# Altium schematic sheet Microcontroller.SchDoc
size A
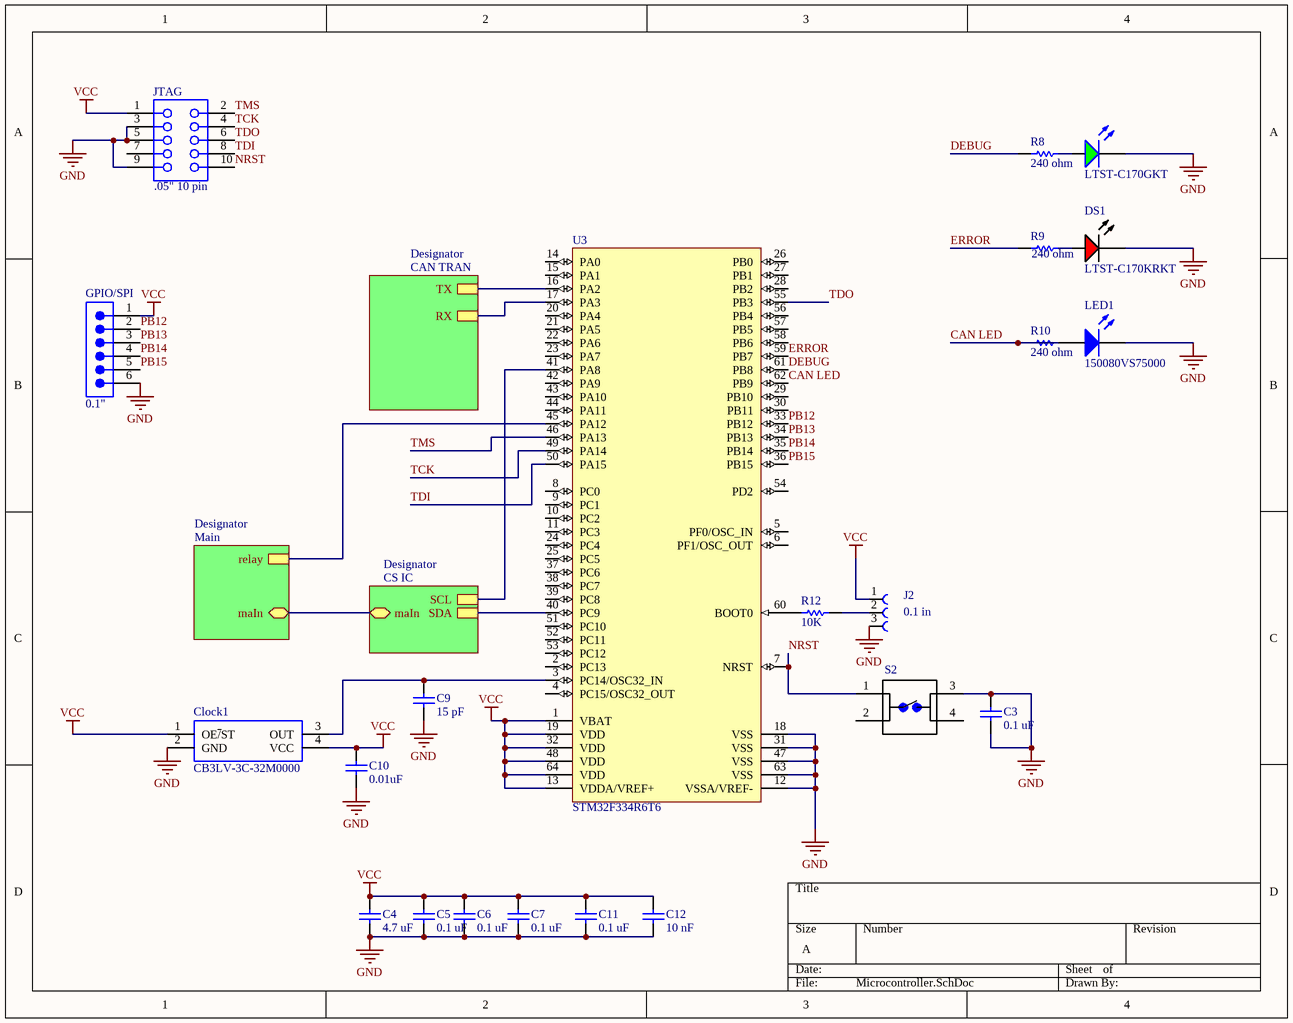
[diagram p0: Microcontroller.SchDoc]

## Parts
?  LTST-C170GKT  [LTST-C170GKT_V]
C3  0.1 uF  [CAPC0805(2012)130_N]
C4  4.7 uF  [CAPC0805(2012)130_N]
C5  0.1 uF  [CAPC0805(2012)130_N]
C6  0.1 uF  [CAPC0805(2012)130_N]
C7  0.1 uF  [CAPC0805(2012)130_N]
C9  15 pF  [CAPC0805(2012)130_N]
C10  0.01uF  [CAPC0805(2012)130_N]
C11  0.1 uF  [CAPC0805(2012)130_N]
C12  10 nF  [CAPC0805(2012)130_N]
Clock1  CB3LV-3C-32M0000  [SG-636]
DS1  LTST-C170KRKT  [LTST-C170KRKT_V]
GPIO/SPI  0.1"  [SMTC-TSW-106-23-X-S]
J2  0.1 in  [61300311121]
JTAG  .05" 10 pin  [PCE-FH127H432-10-SNGRH-2.4]
LED1  150080VS75000  [0805_A]
R8  240 ohm  [RESC0805(2012)_N]
R9  240 ohm  [RESC0805(2012)_N]
R10  240 ohm  [RESC0805(2012)_N]
R12  10K  [RESC0805(2012)_N]
S2  1825910-7  [*SW_1825910-7]  (value not drawn)
U3  STM32F334R6T6  [STM-LQFP64_N]

## Sub-sheets
Designator = CS IC: SDA, SCL, maIn (bidir)
Designator = CAN TRAN: TX, RX
Designator = Main: maIn (bidir), relay

## Nets
GND: ?.C C3.1 C3.2 C4.1 C5.1 C6.1 C7.1 C9.1 C10.1 C11.1 C12.1 Clock1.2(GND) DS1.2(K) GPIO/SPI.6 J2.3 JTAG.3 JTAG.5 JTAG.9 LED1.1(K) S2.3 U3.12(VSSA/VREF-) U3.18(VSS) U3.31(VSS) U3.47(VSS) U3.63(VSS)
VCC: C4.2 C5.2 C6.2 C7.2 C10.2 C11.2 C12.2 Clock1.1(OE~{/}ST) Clock1.4(VCC) GPIO/SPI.1 J2.1 JTAG.1 U3.1(VBAT) U3.13(VDDA/VREF+) U3.19(VDD) U3.32(VDD) U3.48(VDD) U3.64(VDD)
CAN LED: LED1.2(A) R10.1 U3.62(PB9)
DEBUG: R8.1 U3.61(PB8)
ERROR: R9.2 U3.59(PB7)
NRST: JTAG.10 S2.1 U3.7(NRST)
PB12: GPIO/SPI.2 U3.33(PB12)
PB13: GPIO/SPI.3 U3.34(PB13)
PB14: GPIO/SPI.4 U3.35(PB14)
PB15: GPIO/SPI.5 U3.36(PB15)
TCK: JTAG.4 U3.49(PA14)
TDI: JTAG.8 U3.50(PA15)
TDO: JTAG.6 U3.55(PB3)
TMS: JTAG.2 U3.46(PA13)
Net?_A: ?.A R8.2
NetC9_2: C9.2 Clock1.3(OUT) U3.3(PC14/OSC32_IN)
NetDS1_1: DS1.1(A) R9.1
NetJ2_2: J2.2 R12.1
NetR12_2: R12.2 U3.60(BOOT0)
NetU3_16: U3.16(PA2) ; sheet Designator/TX
NetU3_17: U3.17(PA3) ; sheet Designator/RX
NetU3_40: U3.40(PC9) ; sheet Designator/SDA
NetU3_41: U3.41(PA8) ; sheet Designator/SCL
NetU3_45: U3.45(PA12) ; sheet Designator/relay
(unnamed): sheet Designator/maIn, sheet Designator/maIn

Not connected (* = marked no-connect by the designer): JTAG 7; R10 2; S2 2 4; U3 2(PC13) 4(PC15/OSC32_OUT) 5(PF0/OSC_IN) 6(PF1/OSC_OUT) 8(PC0) 9(PC1) 10(PC2) 11(PC3) 14(PA0) 15(PA1) 20(PA4) 21(PA5) 22(PA6) 23(PA7) 24(PC4) 25(PC5) 26(PB0) 27(PB1) 28(PB2) 29(PB10) 30(PB11) 37(PC6) 38(PC7) 39(PC8) 42(PA9) 43(PA10) 44(PA11) 51(PC10) 52(PC11) 53(PC12) 54(PD2) 56(PB4) 57(PB5) 58(PB6)

## Library data of the parts
? = CMP-1674-00002-1: LED GREEN CLEAR 0805 SMD; PackageReference: C170GKT; ComponentLink1Description: Datasheet; ComponentLink1URL: http://media.digikey.com/pdf/Data%20Sheets/Lite-On%20PDFs/LTST-C170GKT.pdf; PartNumber: LTST-C170GKT
C3-C7 C9-C12 = CMP-1036-02603-1: CAP 390pF 200V ±5% 0805 (2012 Metric) Thickness 1.3mm SMD; Case-Metric: 2012; Case-EIA: 0805; Tolerance: Â±5%; Max Thickness: 1.3 mm; Rated Voltage: 200 V; Technology: SMT; Value: 390pF
Clock1 = SG-636: Standard Clock Oscillators 50MHz 3.3Volt 100ppm -20C +70C; Manufacturer_Name: Epson Timing; Manufacturer_Part_Number: SG-636PCW 50.0000MC3: ROHS; RS Part Number: *; RS Price/Stock: *; Arrow Part Number: SG-636PCW 50.0000MC3: ROHS; Arrow Price/Stock: *; Datasheet Link: http://www.mouser.com/ds/2/137/G-636PCE_en-1003252.pdf; ComponentLink1Description: datasheet; ComponentLink1URL: https://www.digikey.com/product-detail/en/abracon-llc/ASE-32.000MHZ-ET/535-9990-1-ND/2001613
DS1 = CMP-2000-07593-1: LED Red, 75 mW, 54 mcd, -55 to 85 degC, 2-Pin SMD, RoHS, Tape and Reel; Manufacturer: Lite-On; Lens Transparency: Clear; Number of Elements: 1; Power Rating: 75mW; Luminous Intensity: 54mcd; Viewing Angle: 130degrees; Forward Current: 30mA; Wavelength: 639nm; Lens Style: Rectangular; Case\/Package: 0805; Test Current: 20mA; Dominant Wavelength: 631nm; Forward Voltage: 2V; Lens Colour: Colorless; Min Operating Temperature: -55degC; RoHSCompliant: True; Length: 3.2mm; Width: 1.25mm; Mount: SurfaceMount; Packaging: TapeandReel; Number of LEDs: 1; Radiation Hardening: No; Datasheet URL: http://optoelectronics.liteon.com/upload/download/DS-22-99-0150/LTST-C170KRKT.pdf; Datasheet Version: Rev. D, 11/2014; Case Code (Metric): 2012; Height: 1.1mm; Number of Pins: 2; Package Description: 2-Pin Surface Mount Device, Body 2 x 1.25 mm; Manufacturer URL: http://www.us.liteon.com/; Lead Free: LeadFree; Illumination Colour: Red; Colour: Red; Case Code (Imperial): 0805; Max Operating Temperature: 85degC; Power Dissipation: 75mW; Mounting Technology: SurfaceMount; Package Reference: C170KRKT; Package Quantity: 1; Depth: 1.6mm
GPIO/SPI = CMP-1024-00395-1: 0.025" SQ Post Header, Through-hole, Vertical, -55 to 105 degC, 2.54 mm Pitch, 6-Pin, Male, RoHS; Manufacturer: Samtec; PartNumber: TSW-106-23-T-S; Pitch: 2.54 mm; PackageReference: TSW-106-23-X-S; ComponentLink1URL: http://www.samtec.com; ComponentLink1Description: Manufacturer URL; PackageVersion: DM, 8/1988; ComponentLink2Description: Datasheet; Mounting Technology: Through-hole; Orientation: Vertical; ComponentLink2URL: http://www.samtec.com/documents/webfiles/pdf/TSW_TH.PDF; PackageDescription: .025[0.64] SQ. Post Terminal Strip Assembly; ComponentLink3Description: Package Specification; RoHS: True; DatasheetVersion: F-214; Temperature Range: -55 to 105 degC; ComponentLink3URL: http://www.samtec.com/documents/webfiles/cpdf/TSW-XXX-XX-XXX-X-XX-XXX-MKT.pdf
J2 = 61300311121: Board-To-Board Connector, Vertical, WR-PHD Series, Through Hole, Header, 3, 2.54 mm; MF: Wurth Electronics; Package: None; MP: 61300311121; SnapEDA_Link: https://www.snapeda.com/parts/61300311121/Wurth%20Electronics%20Inc./view-part/?ref=snap; Availability: Unavailable; Price: None; Value: *
JTAG = CMP-0594-00001-1: Female Header, Pitch 1.27 mm, 2x5 Position, Height 4.3 mm, Tail Length 2.4 mm; PartNumber: FH127H432-10-SNGRH-2.4; Manufacturer: Pinchao Electronic; Insulator resistance (Min.): 5000 Megohms; No. of Rows: 2; Insulator Material: NY-6T; No. of positions: 10; Dielectric Withstaanding: AC 500 V; Current Rating: 2 Amps; Pitch: 1.27 mm; Plating: Gold Flash; ComponentLink1URL: http://www.suzhoupinchao.com/; PackageDescription: Female Header, Pitch 1.27 mm, 2x5 Position, Height 4.3 mm, Tail Length 2.4 mm; ComponentLink1Description: Manufacturer URL; Connector Type: Female Header; Mounting Technology: Through Hole; PackageReference: FH127H432-10-SNGRH-2.4; Operating Temperature: -40 to 105 degC
LED1 = CMP-1426-00009-1: SMD mono-color Chip LED, WL-SMCW, Bright Green; Manufacturer: Wuerth Elektronik; ComponentLink1Description: Manufacturer URL; Color: Bright Green; PackageReference: 0805_A; PartNumber: 150080VS75000; ComponentLink1URL: http://www.we-online.com; ComponentLink2Description: Datasheet; ComponentLink2URL: http://katalog.we-online.com/led/datasheet/150080VS75000.pdf
R8-R10 R12 = CMP-1013-00418-1: 160R 0.125W 1% 0805 (2012 Metric)  SMD; Case-Metric: 2012; Case-EIA: 0805; Value: 160.00 Ohm; Technology: SMT; Tolerance: 1 %; Power: 0.125 W
S2 = 1825910-7: FSM4JAH=6MM TACT SWITCH, HIGH TEMP; Contact_Current_Rating: 50 mA; MF: TE Connectivity; Configuration_Pole-Throw: Single Pole - Single Throw; Package: None; Price: None; MP: 1825910-7; EU_RoHS_Compliance: Compliant; SnapEDA_Link: https://www.snapeda.com/parts/1825910-7/TE%20Connectivity%20ALCOSWITCH%20Switches/view-part/?ref=snap; Availability: Unavailable; TE_purchase_URL: https://www.te.com/usa-en/product-1825910-7.html?te_bu=Cor&te_type=disp&te_campaign=seda_glo_cor-seda-global-disp-prtnr-fy19-seda-model-bom-cta_sma-317_1&elqCampaignId=32493; Value: *
U3 = STM32F334R6T6: ARM Cortex-M4 32-bit MCU, 64-Pin LQFP, 32 KB Flash, 16 KB Internal RAM, 51 I/Os, -40 to 85 degC, Tray